# Altium schematic sheet IWRL6432.SchDoc
size A4; SheetNumber: 2; SheetTotal: 4
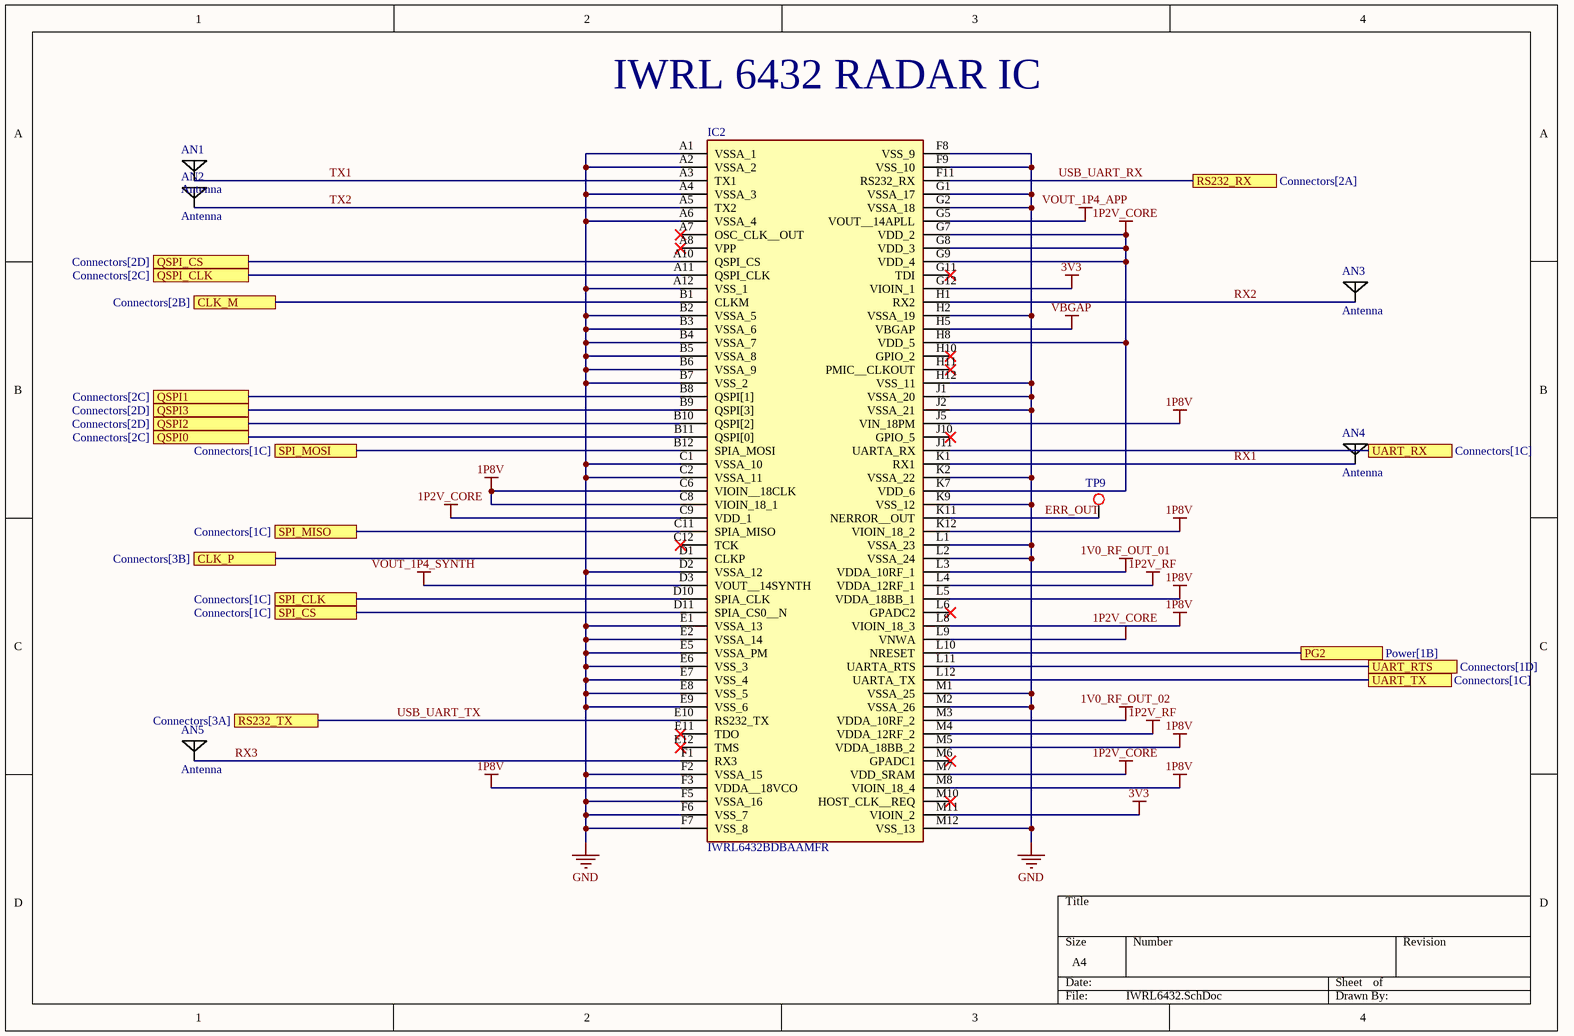
[diagram p0: IWRL6432.SchDoc]

## Parts
AN1  Antenna  [Antenna]
AN2  Antenna  [Antenna]
AN3  Antenna  [Antenna]
AN4  Antenna  [Antenna]
AN5  Antenna  [Antenna]
IC2  IWRL6432BDBAAMFR  [BGA102C50P12X12_645X645X97]
TP9  TP_1  [Testpoint]  (value not drawn)

## Ports
CLK_M (see Connectors[2B]), CLK_P (see Connectors[3B]), PG2 (see Power[1B]), QSPI0 (see Connectors[2C]), QSPI1 (see Connectors[2C]), QSPI2 (see Connectors[2D]), QSPI3 (see Connectors[2D]), QSPI_CLK (see Connectors[2C]), QSPI_CS (see Connectors[2D]), RS232_RX (see Connectors[2A]), RS232_TX (see Connectors[3A]), SPI_CLK (see Connectors[1C]), SPI_CS (see Connectors[1C]), SPI_MISO (see Connectors[1C]), SPI_MOSI (see Connectors[1C]), UART_RTS (see Connectors[1D]), UART_RX (see Connectors[1C]), UART_TX (see Connectors[1C])

## Nets
1P2V_CORE: IC2.C9(VDD_1) IC2.G7(VDD_2) IC2.G8(VDD_3) IC2.G9(VDD_4) IC2.H8(VDD_5) IC2.K7(VDD_6) IC2.L9(VNWA) IC2.M7(VDD_SRAM)
1P2V_RF: IC2.L4(VDDA_12RF_1) IC2.M4(VDDA_12RF_2)
1P8V: IC2.C6(VIOIN__18CLK) IC2.C8(VIOIN_18_1) IC2.F3(VDDA__18VCO) IC2.J5(VIN_18PM) IC2.K12(VIOIN_18_2) IC2.L5(VDDA_18BB_1) IC2.L8(VIOIN_18_3) IC2.M5(VDDA_18BB_2) IC2.M8(VIOIN_18_4)
1V0_RF_OUT_01: IC2.L3(VDDA_10RF_1)
1V0_RF_OUT_02: IC2.M3(VDDA_10RF_2)
3V3: IC2.G12(VIOIN_1) IC2.M11(VIOIN_2)
GND: IC2.A1(VSSA_1) IC2.A2(VSSA_2) IC2.A4(VSSA_3) IC2.A6(VSSA_4) IC2.A12(VSS_1) IC2.B2(VSSA_5) IC2.B3(VSSA_6) IC2.B4(VSSA_7) IC2.B5(VSSA_8) IC2.B6(VSSA_9) IC2.B7(VSS_2) IC2.C1(VSSA_10) IC2.C2(VSSA_11) IC2.D2(VSSA_12) IC2.E1(VSSA_13) IC2.E2(VSSA_14) IC2.E5(VSSA_PM) IC2.E6(VSS_3) IC2.E7(VSS_4) IC2.E8(VSS_5) IC2.E9(VSS_6) IC2.F2(VSSA_15) IC2.F5(VSSA_16) IC2.F6(VSS_7) IC2.F7(VSS_8) IC2.F8(VSS_9) IC2.F9(VSS_10) IC2.G1(VSSA_17) IC2.G2(VSSA_18) IC2.H2(VSSA_19) IC2.H12(VSS_11) IC2.J1(VSSA_20) IC2.J2(VSSA_21) IC2.K2(VSSA_22) IC2.K9(VSS_12) IC2.L1(VSSA_23) IC2.L2(VSSA_24) IC2.M1(VSSA_25) IC2.M2(VSSA_26) IC2.M12(VSS_13)
VBGAP: IC2.H5(VBGAP)
VOUT_1P4_APP: IC2.G5(VOUT__14APLL)
VOUT_1P4_SYNTH: IC2.D3(VOUT__14SYNTH)
CLK_M: IC2.B1(CLKM) ; port CLK_M
CLK_P: IC2.D1(CLKP) ; port CLK_P
ERR_OUT: IC2.K11(NERROR__OUT) TP9.0
PG2: IC2.L10(NRESET) ; port PG2
QSPI0: IC2.B11(QSPI[0]) ; port QSPI0
QSPI1: IC2.B8(QSPI[1]) ; port QSPI1
QSPI2: IC2.B10(QSPI[2]) ; port QSPI2
QSPI3: IC2.B9(QSPI[3]) ; port QSPI3
QSPI_CLK: IC2.A11(QSPI_CLK) ; port QSPI_CLK
QSPI_CS: IC2.A10(QSPI_CS) ; port QSPI_CS
RX1: AN4.0 IC2.K1(RX1)
RX2: AN3.0 IC2.H1(RX2)
RX3: AN5.0 IC2.F1(RX3)
SPI_CLK: IC2.D10(SPIA_CLK) ; port SPI_CLK
SPI_CS: IC2.D11(SPIA_CS0__N) ; port SPI_CS
SPI_MISO: IC2.C11(SPIA_MISO) ; port SPI_MISO
SPI_MOSI: IC2.B12(SPIA_MOSI) ; port SPI_MOSI
TX1: AN1.0 IC2.A3(TX1)
TX2: AN2.0 IC2.A5(TX2)
UART_RTS: IC2.L11(UARTA_RTS) ; port UART_RTS
UART_RX: IC2.J11(UARTA_RX) ; port UART_RX
UART_TX: IC2.L12(UARTA_TX) ; port UART_TX
USB_UART_RX: IC2.F11(RS232_RX) ; port RS232_RX
USB_UART_TX: IC2.E10(RS232_TX) ; port RS232_TX

Not connected (* = marked no-connect by the designer): IC2 A7(OSC_CLK__OUT)* A8(VPP)* C12(TCK)* E11(TDO)* E12(TMS)* G11(TDI)* H10(GPIO_2)* H11(PMIC__CLKOUT)* J10(GPIO_5)* L6(GPADC2)* M6(GPADC1)* M10(HOST_CLK__REQ)*

## Notes on the sheet
- IWRL 6432 RADAR IC

## Library data of the parts
IC2 = IWRL6432BDBAAMFR: Integrated Circuit; Manufacturer_Name: Texas Instruments; Datasheet Link: https://www.ti.com/lit/ds/symlink/iwrl6432.pdf; Height: 0.97mm; Manufacturer_Part_Number: IWRL6432BDBAAMFR
TP9 = Testpoint